# Altium schematic sheet POWER.SchDoc
size A3
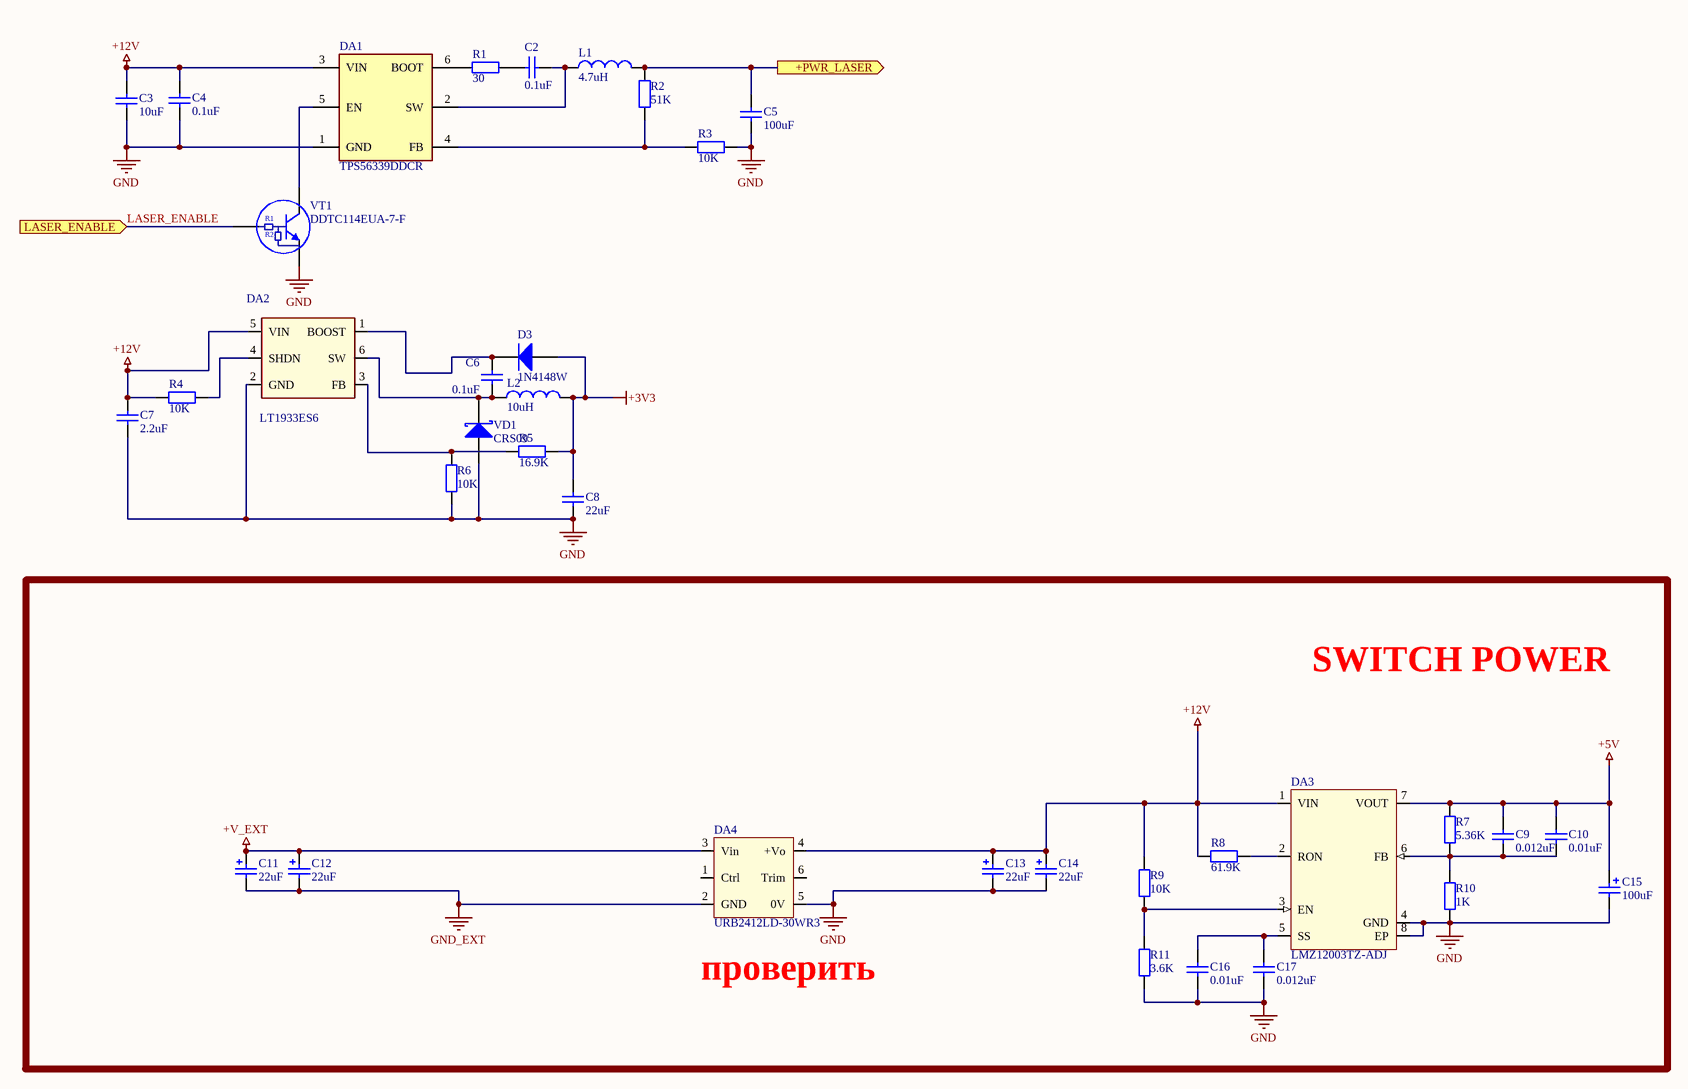
[diagram p0: POWER.SchDoc]

## Parts
C2  value 0.1uF  [C0603]  (hidden comment: C0603-0.1uF-50V-X7R)
C3  value 10uF  [C1210]  (hidden comment: C1210-10uF-50V-X7R)
C4  value 0.1uF  [C0603]  (hidden comment: C0603-0.1uF-50V-X7R)
C5  value 100uF  [C1206]  (hidden comment: C1206-100uF-10V-X5R)
C6  value 0.1uF  [C0603]  (hidden comment: C0603-0.1uF-50V-X7R)
C7  value 2.2uF  [C1206]  (hidden comment: C1206-2.2uF-50V-X7R)
C8  value 22uF  [C0805]  (hidden comment: C0805-22uF-10V-X5R)
C9  value 0.012uF  [C0603]  (hidden comment: C0603-0.012uF-50V-X7R)
C10  value 0.01uF  [C0603]  (hidden comment: C0603-0.01uF-50V-X7R)
C11  value 22uF  [CTD]  (hidden comment: CTD-22uF-35V)
C12  value 22uF  [CTD]  (hidden comment: CTD-22uF-35V)
C13  value 22uF  [CTD]  (hidden comment: CTD-22uF-35V)
C14  value 22uF  [CTD]  (hidden comment: CTD-22uF-35V)
C15  value 100uF  [CTD]  (hidden comment: CTD-100uF-16V)
C16  value 0.01uF  [C0603]  (hidden comment: C0603-0.01uF-50V-X7R)
C17  value 0.012uF  [C0603]  (hidden comment: C0603-0.012uF-50V-X7R)
D3  1N4148W  [SOD323]
DA1  TPS56339DDCR  [SOT23-6]
DA2  LT1933ES6  [SOT23-6]
DA3  LMZ12003TZ-ADJ  [TZA07A]
DA4  URB2412LD-30WR3  [URB2412LD-30WR3]
L1  value 4.7uH  [CDRH8D43]  (hidden comment: CDRH8D43NP-4R7NC)
L2  value 10uH  [VLCF4020T]  (hidden comment: VLCF4020T-100MR85)
R1  value 30  [R0603]  (hidden comment: R0603-30-1%)
R2  value 51K  [R0603]  (hidden comment: R0603-51K-1%)
R3  value 10K  [R0603]  (hidden comment: R0603-10K-1%)
R4  value 10K  [R0603]  (hidden comment: R0603-10K-1%)
R5  value 16.9K  [R0603]  (hidden comment: R0603-16.9K-1%)
R6  value 10K  [R0603]  (hidden comment: R0603-10K-1%)
R7  value 5.36K  [R0603]  (hidden comment: R0603-5.36K-1%)
R8  value 61.9K  [R0603]  (hidden comment: R0603-61.9K-1%)
R9  value 10K  [R0603]  (hidden comment: R0603-10K-1%)
R10  value 1K  [R0603]  (hidden comment: R0603-1K-1%)
R11  value 3.6K  [R0603]  (hidden comment: R0603-3.6K-1%)
VD1  CRS09  [SFLAT]
VT1  DDTC114EUA-7-F  [SOT323]

## Ports
+PWR_LASER (out), LASER_ENABLE (in)

## Nets
+3V3: C8.2 D3.1(A) L2.2 R5.2
+5V: C9.2 C10.2 C15.1 DA3.7(VOUT) R7.2
+12V: C3.2 C4.1 C7.2 C13.1 C14.1 DA1.3(VIN) DA2.5(VIN) DA3.1(VIN) DA4.4(+Vo) R4.2 R8.1 R9.2
+V_EXT: C11.1 C12.1 DA4.3(Vin)
GND: C3.1 C4.2 C5.1 C7.1 C8.1 C13.2 C14.2 C15.2 C16.1 C17.1 DA1.1(GND) DA2.2(GND) DA3.4(GND) DA3.8(EP) DA4.5(0V) R3.1 R6.1 R10.1 R11.1 VD1.1(A) VT1.2(E)
GND_EXT: C11.2 C12.2 DA4.2(GND)
+PWR_LASER: C5.2 L1.2 R2.2 ; port +PWR_LASER
LASER_ENABLE: VT1.1(B) ; port LASER_ENABLE
NetC2_1: C2.1 DA1.2(SW) L1.1
NetC2_2: C2.2 R1.2
NetC6_1: C6.1 DA2.6(SW) L2.1 VD1.2(K)
NetC6_2: C6.2 D3.2(K) DA2.1(BOOST)
NetC9_1: C9.1 C10.1 DA3.6(FB) R7.1 R10.2
NetC16_2: C16.2 C17.2 DA3.5(SS)
NetDA1_4: DA1.4(FB) R2.1 R3.2
NetDA1_5: DA1.5(EN) VT1.3(C)
NetDA1_6: DA1.6(BOOT) R1.1
NetDA2_3: DA2.3(FB) R5.1 R6.2
NetDA2_4: DA2.4(SHDN) R4.1
NetDA3_2: DA3.2(RON) R8.2
NetDA3_3: DA3.3(EN) R9.1 R11.2

Not connected (* = marked no-connect by the designer): DA4 1(Ctrl) 6(Trim)

## Notes on the sheet
- SWITCH POWER
- (near DA4) проверить
- (in symbol DDTC114EUA-7-F) R1; R2

## Library data of the parts
C2 C4 C6 = C0603-0.1uF-50V-X7R: Ceramic Capacitor; Supplier 1: Digi-Key; Supplier Part Number 1: 445-1324-1-ND
C3 = C1210-10uF-50V-X7R: Ceramic Capacitor; Supplier 1: Digi-Key
C5 = C1206-100uF-10V-X5R: Ceramic Capacitor; Supplier 1: Digi-Key; Supplier Part Number 1: 445-6007-1-ND
C7 = C1206-2.2uF-50V-X7R: Ceramic Capacitor; Supplier 1: Digi-Key; Supplier Part Number 1: 1276-2723-2-ND
C8 = C0805-22uF-10V-X5R: Ceramic Capacitor; Supplier 1: Digi-Key; Supplier Part Number 1: 490-10511-1-ND
C9 C17 = C0603-0.012uF-50V-X7R: Ceramic Capacitor; Supplier 1: Digi-Key; Supplier Part Number 1: 490-1513-1-ND
C10 C16 = C0603-0.01uF-50V-X7R: Ceramic Capacitor; Supplier 1: Digi-Key; Supplier 2: Digi-Key; Supplier 3: Digi-Key; Supplier Part Number 1: 445-1311-1-ND; Supplier Part Number 2: 478-1227-1-ND; Supplier Part Number 3: GRM188R61H103KA01D-ND
C11-C14 = CTD-22uF-35V: Tantalum Capacitor; Supplier 1: Digi-Key; Supplier Part Number 1: 478-1730-2-ND
C15 = CTD-100uF-16V: Tantalum Capacitor; Supplier 1: Digi-Key; Supplier Part Number 1: 478-1723-1-ND
D3 = 1N4148W: Diode; Voltage - DC Reverse (Vr) (Max): 75V; Current - Average Rectified (Io): 150mA; Type: DIODE 75V 150MA SOD323F; HelpUrl: \\Storage\Volume_2\SPEKTR-AT\Catalogs\General Semiconductor\Diodes\1N4148W.pdf; Supplier 1: Digi-Key; Supplier Part Number 1: 1N4148WSFSCT-ND
DA1 = TPS56339DDCR: 4.5-V to 24-V Input, 3-A Output Synchronous Buck Converter
DA2 = LT1933ES6: PWM step-down DC/DC / converter; Supplier 1: Digi-Key; Help URL: https://www.analog.com/media/en/technical-documentation/data-sheets/1933fe.pdf; Supplier Part Number 1: LT1933ES6#TRPBFCT-ND
DA4 = URB2412LD-30WR3: DC/DC Converter; HelpUrl: https://www.mornsun-power.com/uploads/pdf/URA_LD-30WR3.pdf
L1 = CDRH8D43NP-4R7NC: Inductor; Current: 4.1A; HelpUrl: http://products.sumida.com/products/pdf/CDRH8D43.pdf?__cf_chl_captcha_tk__=f2dd78b9027a2fe299a3aea71ee132a4cfb9459e-1615548098-0-AWv3dTlkYHb3pOZx47LrfRgQQvnbYyh137kl7uefua50nLxSKUUGrqtlCCjrc1LswX_-r6oJbyvsXa0yR2eZdE77H7aOBf-QBKkOOMSNJ3pig1erzpUNp_TWXk-67akAQoTQvkftj8OlbHqQ4H9RdFe8fQ1CNp0rbmLJm5OjBfnKhuu7dCwp-XrQqmHs-aSAf8GurMArTLM56usz57RsDvF83AfaOxVDPdkr-RR6vFv2ejXMzOBUncU1xYUxw2-FtoS50eUSjk3uK32pDW9RQcB7at0zBTfYb7z1XEUU3cNH-LJQFJ6S0r5aCxNOxKsPMag80AtDB68AL3MlL4250ERsFMEv8i6qyXeCYUzPNYhi5Kb7tXKzIjKI_FhX1Ng3Qx8LpjLxEYYXtRJxk8ucr1dLSxq3fgiNj3w-8N0UD2uklKGxzL9lR3tVA2FN_GumzljjVLssxYWb0rvnE7uglc0dEdjxHXEVFs1mSRKMElWKfz_-O5_flhZzggBpUNnWAvtXJkCTCVIunYUQ6UPsGfkNtnBhdXmaIx3qARKHbMCtbeIkj50XdSCf7pF1-MSMB-QwGxhNOsgDZ-CJKYC0bho; Supplier 1: DigiKey; Supplier Part Number 1: 308-2317-2-ND
L2 = VLCF4020T-100MR85: Inductor; Current: 0.85A; HelpUrl: \\Storage\Volume_2\SPEKTR-AT\Catalogs\Tdk\Inductors\vlcf4020.pdf; Supplier 1: Digi-Key; Supplier Part Number 1: 445-3186-1-ND
R1 = R0603-30-1%: Chip Resistor; Supplier 1: Digi-Key; Supplier Part Number 1: P30.0HCT-ND
R2 = R0603-51K-1%: Chip Resistor; Supplier 1: Digi-Key; Supplier Part Number 1: P51.0KHCT-ND
R3 R4 R6 R9 = R0603-10K-1%: Chip Resistor; Supplier 1: Digi-Key; Supplier Part Number 1: P10.0KHCT-ND
R5 = R0603-16.9K-1%: Chip Resistor; Supplier 1: Digi-Key; Supplier Part Number 1: P16.9KHCT-ND
R7 = R0603-5.36K-1%: Chip Resistor; Supplier 1: Digi-Key; Supplier Part Number 1: P5.36KHCT-ND
R8 = R0603-61.9K-1%: Chip Resistor; Supplier 1: Digi-Key; Supplier Part Number 1: P61.9KHCT-ND
R10 = R0603-1K-1%: Chip Resistor; Supplier 1: Digi-Key; Supplier Part Number 1: P1.00KHCT-ND
R11 = R0603-3.6K-1%: Chip Resistor; Supplier 1: Digi-Key; Supplier Part Number 1: P3.60KHCT-ND
VD1 = CRS09(TE85L,Q,M): Diode Schottky; Supplier 1: Digi-Key; Supplier Part Number 1: CRS09QCT-ND
VT1 = DDTC114EUA-7-F: NPN; Vin: -10...40 V; Iout: 50...100 mA; Vout: 0.1V; Type: TRANS PREBIAS NPN 200MW SC70-3; HelpUrl: \\storage\volume_2\SPEKTR-AT\Catalogs\Rohm\Transistors\DTC114EE.pdf; Supplier 1: Digi-Key; Supplier Part Number 1: DDTC114EUA-FDICT-ND
DA3 = LMZ12003TZ-ADJ: Type: 1A SIMPLE SWITCHER® Power Module with 20V Maximum  Input Voltage; HelpUrl: *